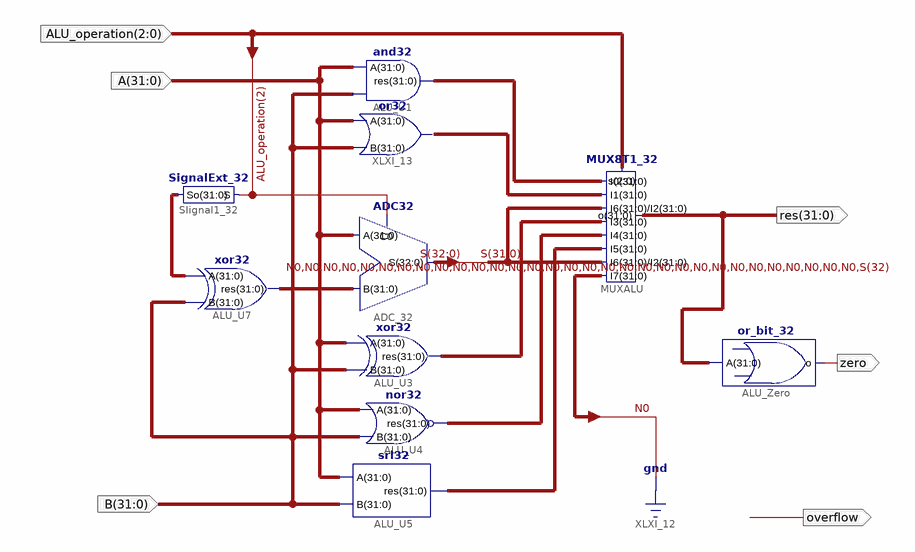
[diagram p0: schematic sheet 1]
// Xilinx ISE schematic ALU.sch (kintex7) as structural Verilog: 10 symbols, 6 ports
module ALU (
  input  [31:0] B,
  input  [31:0] A,
  input  [2:0] ALU_operation,
  output [31:0] res,
  output zero,
  output overflow
);

  wire [31:0] XLXN_2, XLXN_3, XLXN_17, XLXN_19, XLXN_22, XLXN_23, XLXN_24;
  wire [32:0] S;

  ADC32 ADC_32 (.B(XLXN_3), .A(A), .C0(ALU_operation[2]), .S(S));
  and32 ALU_U1 (.res(XLXN_17), .A(A), .B(B));
  xor32 ALU_U3 (.A(A), .B(B), .res(XLXN_22));
  nor32 ALU_U4 (.res(XLXN_23), .A(A), .B(B));
  srl32 ALU_U5 (.A(A), .B(B), .res(XLXN_24));
  xor32 ALU_U7 (.A(XLXN_2), .B(B), .res(XLXN_3));
  or_bit_32 ALU_Zero (.o(zero), .A(res));
  MUX8T1_32 MUXALU (
    .s(ALU_operation), .I7({{31{1'b0}}, S[32]}), .I6(S[31:0]), .I5(XLXN_24), .I4(XLXN_23), .I3(XLXN_22),
    .I2(S[31:0]), .I1(XLXN_19), .I0(XLXN_17), .o(res));
  SignalExt_32 SIignal1_32 (.So(XLXN_2), .S(ALU_operation[2]));
  or32 XLXI_13 (.res(XLXN_19), .A(A), .B(B));
endmodule
